# EAGLE design BLE Master (EAGLE 7.1.0)
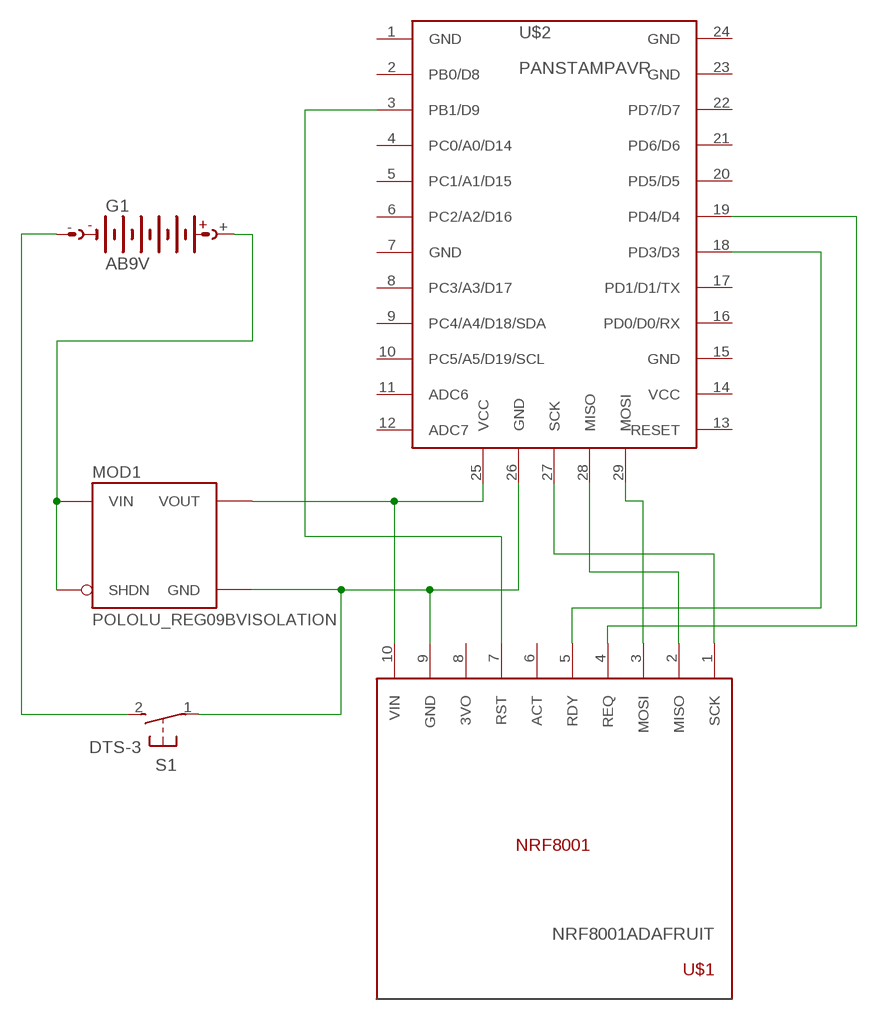
[diagram p0: schematic, sheet 1]

## Parts
G1  AB9V  [AB9V]
MOD1  POLOLU_REG09BVISOLATION  [POLOLU_REG09B_ISO]
S1  DTS-3  [DTS-3]
U$1  NRF8001ADAFRUIT  [NRF8001_ADAFRUIT]
U$2  PANSTAMPAVR  [PANSTAMP]

## Nets
N$1: G1.+ MOD1.I(VIN) MOD1.S(SHDN)
N$2: G1.- S1.2
N$3: MOD1.G(GND) S1.1 U$1.9(GND) U$2.26(GND)
N$4: U$1.1(SCK) U$2.27(SCK)
N$5: U$1.2(MISO) U$2.28(MISO)
N$6: U$1.3(MOSI) U$2.29(MOSI)
N$7: U$1.4(REQ) U$2.19(PD4/D4)
N$8: U$1.5(RDY) U$2.18(PD3/D3)
N$9: U$1.7(RST) U$2.3(PB1/D9)
N$10: MOD1.O(VOUT) U$1.10(VIN) U$2.25(VCC)
Unconnected: U$1.6(ACT) U$1.8(3VO) U$2.1(GND) U$2.2(PB0/D8) U$2.4(PC0/A0/D14) U$2.5(PC1/A1/D15) U$2.6(PC2/A2/D16) U$2.7(GND) U$2.8(PC3/A3/D17) U$2.9(PC4/A4/D18/SDA) U$2.10(PC5/A5/D19/SCL) U$2.11(ADC6) U$2.12(ADC7) U$2.13(RESET) U$2.14(VCC) U$2.15(GND) U$2.16(PD0/D0/RX) U$2.17(PD1/D1/TX) U$2.20(PD5/D5) U$2.21(PD6/D6) U$2.22(PD7/D7) U$2.23(GND) U$2.24(GND)

## Library data of the parts
G1 = battery:AB9V: 9-V BATTERY CLIP
MOD1 = My Library:POLOLU_REG09B*V: Pololu Adjustable Step Up/Down Voltage Regulators REG09B 0.4"x0.6" SOURCE www.pololu.com/ PACKAGE THT; 4-pin (0.1"); 0.4"x0.6"
S1 = switch-tact:DTS-3
U$1 = My Library:NRF8001
U$2 = My Library:PANSTAMP

## Board
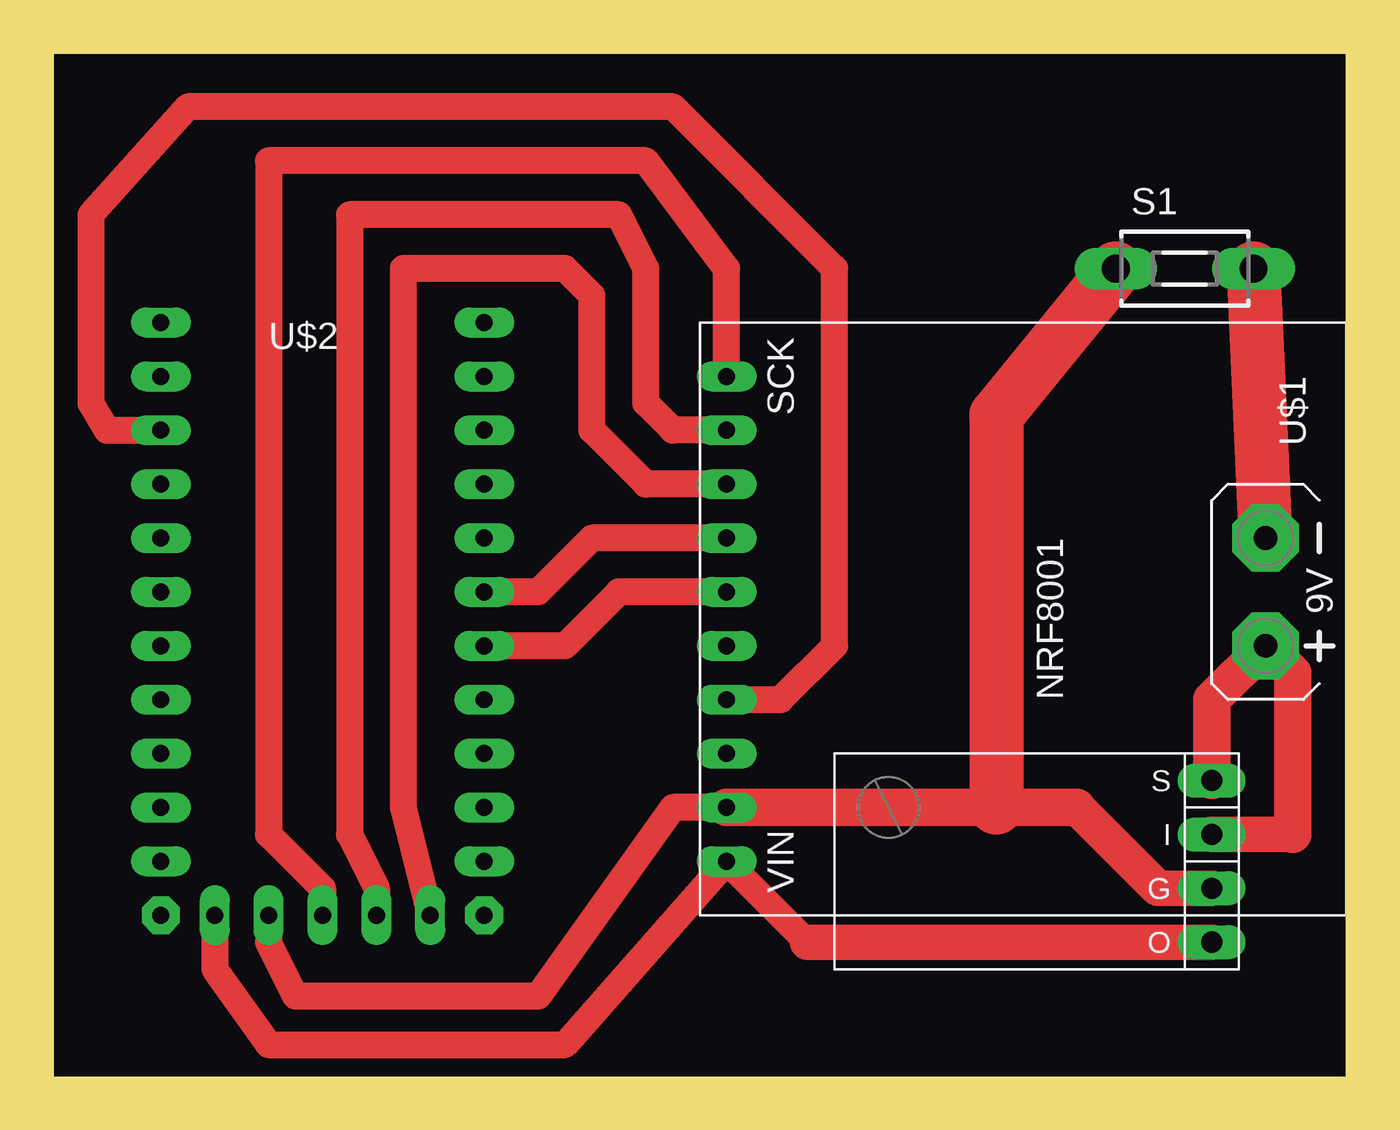
[diagram p1: board, top side]

Size 60.96 x 48.26 mm. Coordinates in mm from the lower left corner, seen from the top.
Outline: 0,0 60.96,0 60.96,48.26 0,48.26 0,0
Copper layers (1*16): Top 0.035mm / dielectric 1.5mm / Bottom 0.035mm
Design rules "ShopBot": minimum track width 8mil, minimum drill 20mil, track to track 32mil, track to pad 32mil, pad to pad 16mil, via to via 8mil, smd to smd 8mil, copper to edge 10mil, drill to drill 8mil, minimum pad ring 12mil, minimum via ring 10mil, stop-mask expansion 0mil, vias tented up to drill 25mil, thermal gap 10mil
Milling: 4 lines

### Footprints (pad centres in the part's own frame; a part is rotated, then mirrored left to right if it is on the bottom)
AB9V = drill 1.118 pad 3.15 octagon: + 0,2.54; - 0,-2.54
POLOLU_REG09B_ISO = drill 1 long: G -1.27,-8.89; I 1.27,-8.89; O -3.81,-8.89; S 3.81,-8.89
DTS-3 = drill 1.3 long: 1 -3.25,0; 2 3.25,0
NRF8001_ADAFRUIT = drill 0.8 long: 1 2.54,1.27; 2 5.08,1.27; 3 7.62,1.27; 4 10.16,1.27; 5 12.7,1.27; 6 15.24,1.27; 7 17.78,1.27; 8 20.32,1.27; 9 22.86,1.27; 10 25.4,1.27
PANSTAMP = drill 0.8 long: 1 -7.62,12.7; 2 -7.62,10.16; 3 -7.62,7.62; 4 -7.62,5.08; 5 -7.62,2.54; 6 -7.62,0; 7 -7.62,-2.54; 8 -7.62,-5.08; 9 -7.62,-7.62; 10 -7.62,-10.16; 11 -7.62,-12.7; 14 7.62,-12.7; 15 7.62,-10.16; 16 7.62,-7.62; 17 7.62,-5.08; 18 7.62,-2.54; 19 7.62,0; 20 7.62,2.54; 21 7.62,5.08; 22 7.62,7.62; 23 7.62,10.16; 24 7.62,12.7; 25 -5.08,-15.24; 26 -2.54,-15.24; 27 0,-15.24; 28 2.54,-15.24; 29 5.08,-15.24 | drill 0.8 pad 1.778 octagon: 12 -7.62,-15.24; 13 7.62,-15.24

### Placement (x,y rotation side)
G1  57.15,22.86 180 top
MOD1  45.72,10.16 90 top
S1  53.34,38.1 0 top
U$1  30.48,35.56 270 top
U$2  12.7,22.86 0 top

### Tracks (layer width: path | path; a pad name or v marks a point on that pad's centre or on a via)
N$1
  Top 1.676: MOD1.I 58.42,11.43
  Top 1.778: MOD1.S 54.61,17.78 G1.+ 58.42,19.05 58.42,11.43
N$2
  Top 2.54: G1.- S1.2
N$3
  Top 1.27: U$1.9 29.21,12.7 22.86,3.81 11.43,3.81 10.16,6.35 U$2.26
  Top 1.676: MOD1.G 52.07,8.89 48.26,12.7
  Top 1.778: 48.26,12.7 44.45,12.7 U$1.9
  Top 2.54: S1.1 44.45,31.19 44.45,12.7
N$4
  Top 1.27: U$1.1 31.75,38.1 27.94,43.18 10.16,43.18 10.16,11.43 12.7,8.89 U$2.27
N$5
  Top 1.27: U$1.2 29.21,30.48 27.94,31.75 27.94,38.1 26.67,40.64 13.97,40.64 13.97,11.43 15.24,8.89 U$2.28
N$6
  Top 1.27: U$1.3 27.94,27.94 25.4,30.48 25.4,36.83 24.13,38.1 16.51,38.1 16.51,12.7 U$2.29
N$7
  Top 1.27: U$1.4 25.4,25.4 22.86,22.86 U$2.19
N$8
  Top 1.27: U$1.5 26.67,22.86 24.13,20.32 U$2.18
N$9
  Top 1.27: U$1.7 34.29,17.78 36.83,20.32 36.83,38.1 29.21,45.72 6.35,45.72 1.78,40.64 1.78,31.75 2.54,30.48 U$2.3
N$10
  Top 1.27: U$2.25 7.62,5.08 10.16,1.52 24.13,1.52 U$1.10 35.56,6.35
  Top 1.676: MOD1.O 35.56,6.35